# EAGLE schematic MM4_r0 (EAGLE 6.1)
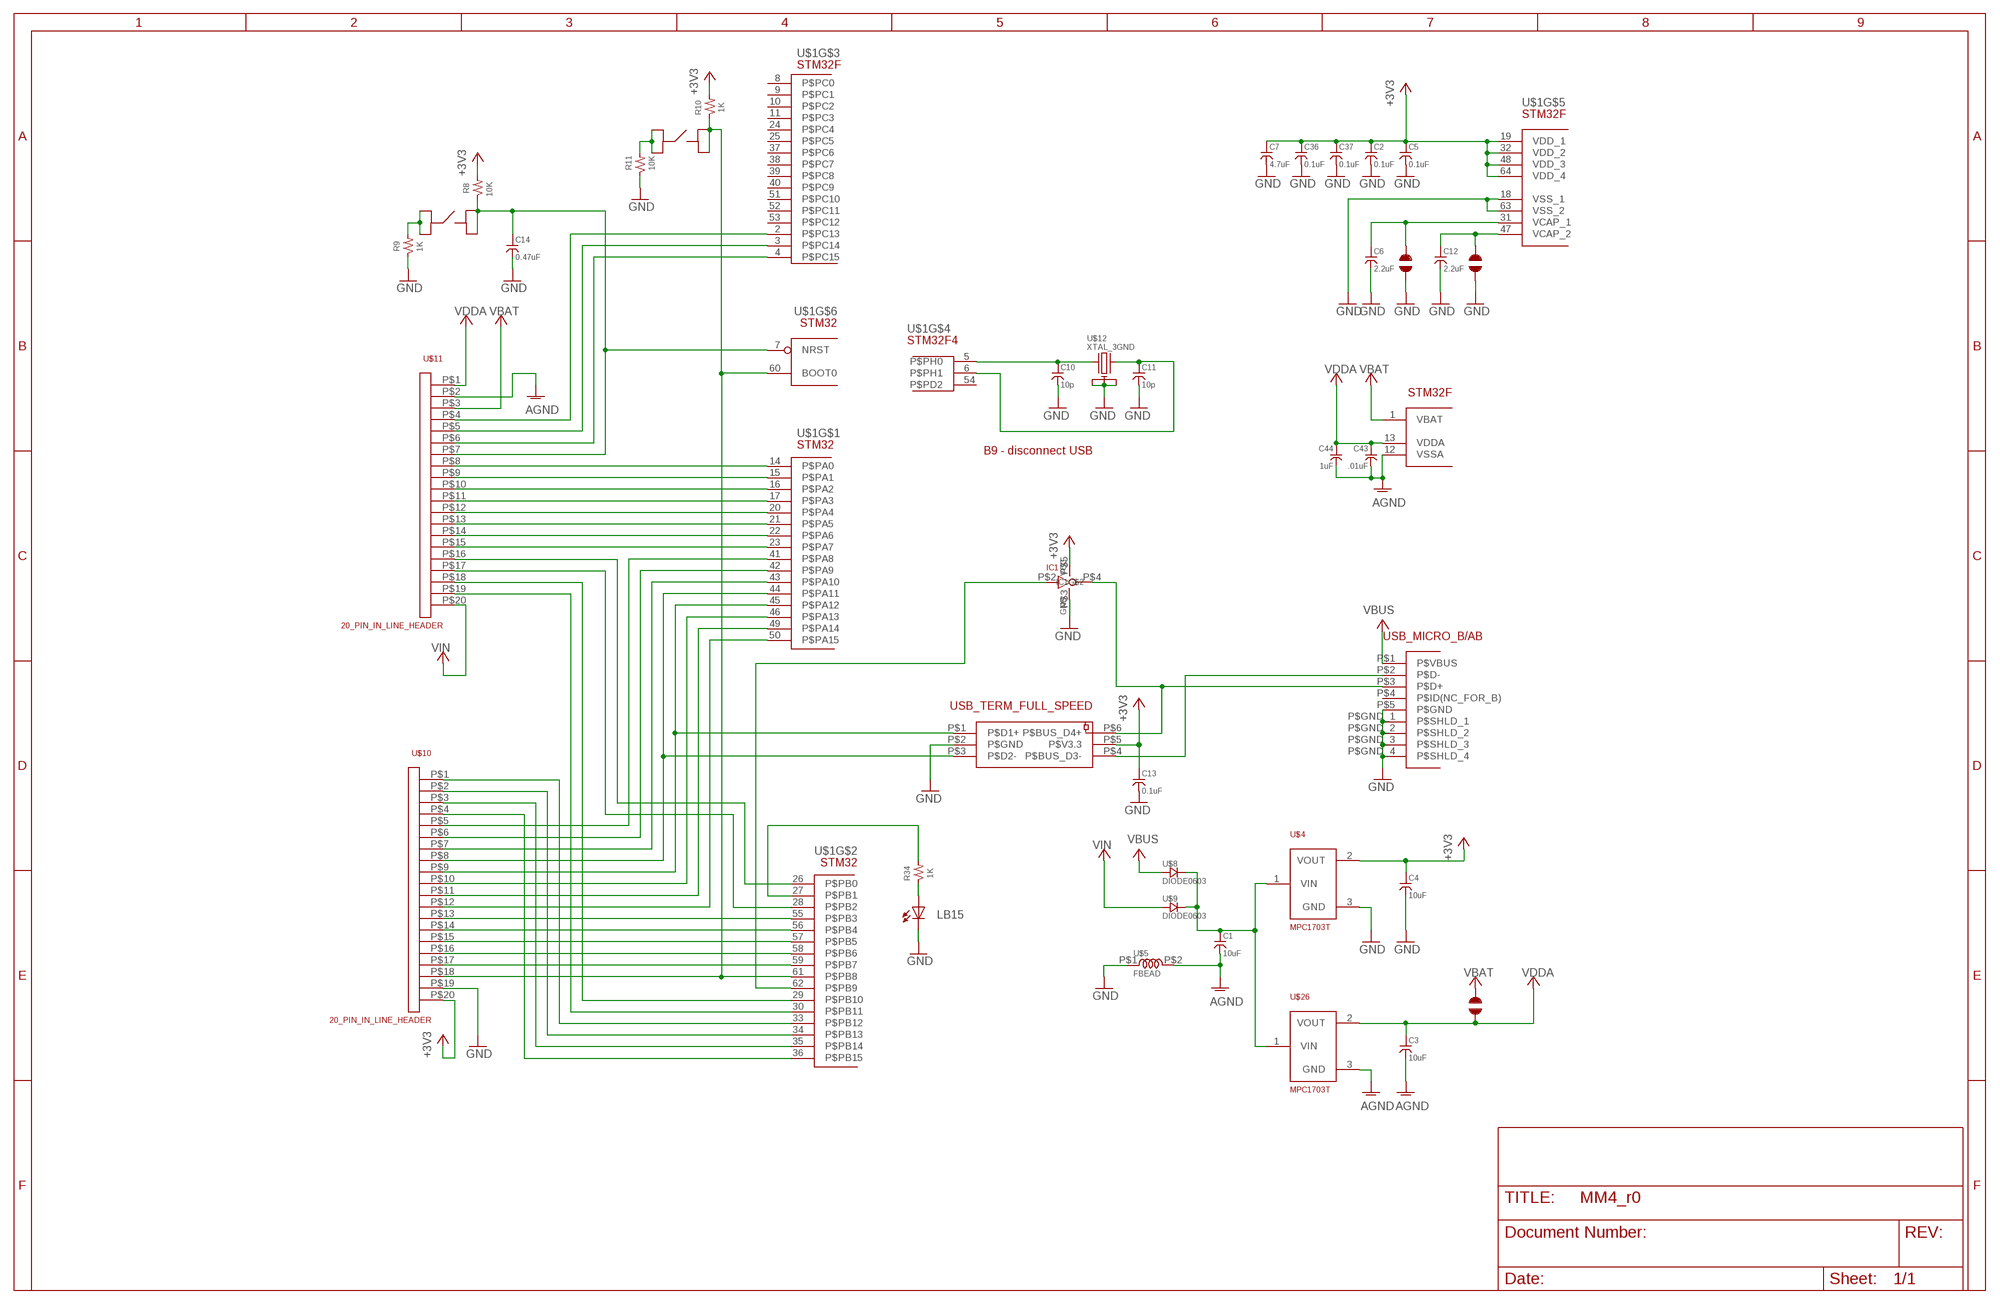
[diagram p0: schematic, sheet 1]

## Parts
C1  10uF  CAP0603  [0603]
C2  0.1uF  CAP0603  [0603]
C3  10uF  CAP0603  [0603]
C4  10uF  CAP0603  [0603]
C5  0.1uF  CAP0603  [0603]
C6  2.2uF  CAP0603  [0603]
C7  4.7uF  CAP0603  [0603]
C10  10p  CAP0603  [0603]
C11  10p  CAP0603  [0603]
C12  2.2uF  CAP0603  [0603]
C13  0.1uF  CAP0603  [0603]
C14  0.47uF  CAP0603  [0603]
C36  0.1uF  CAP0603  [0603]
C37  0.1uF  CAP0603  [0603]
C43  .01uF  CAP0603  [0603]
C44  1uF  CAP0603  [0603]
IC1  7SZ05  LOG_7SZ05  [SC-70-5]
LB15  LED_CMD280603+  [0603+]
R8  10K  RESISTOR0603  [0603]
R9  1K  RESISTOR0603  [0603]
R10  1K  RESISTOR0603  [0603]
R11  10K  RESISTOR0603  [0603]
R34  1K  RESISTOR0603  [0603]
U$1  STM32F40XRG  [TQFP64]
U$2  JUMPER_SOLDER  [JUMPER]
U$3  JUMPER_SOLDER  [JUMPER]
U$4  MPC1703T  [SOT23-3]
U$5  FBEAD  [BEAD_0603]
U$8  DIODE0603  [0603_DIODE]
U$9  DIODE0603  [0603_DIODE]
U$10  20_PIN_IN_LINE_HEADER  [20_PIN_IN_LINE]
U$11  20_PIN_IN_LINE_HEADER  [20_PIN_IN_LINE]
U$12  XTAL_3GND  [XTAL=TXC7M-3]
U$13  JUMPER_SOLDER  [JUMPER]
U$14  MICRO_USB_B  MICRO_USB_BMICRO  [USB-ZX-62-B-5PA]
U$23  USB_TERM_FS  [SOT-666IP]
U$24  SW_SMD_TACTILE  [SW_SMD_TACTILE]
U$25  SW_SMD_TACTILE  [SW_SMD_TACTILE]
U$26  MPC1703T  [SOT23-3]

## Nets
+3V3 [power]: C2.P$1 C4.P$1 C5.P$1 C7.P$1 C13.P$1 C36.P$1 C37.P$1 IC1.P$5(VCC) R8.P$1 R10.P$1 U$1.19(VDD_1) U$1.32(VDD_2) U$1.48(VDD_3) U$1.64(VDD_4) U$4.2(VOUT) U$10.P$20 U$23.P$5(P$V3.3)
AGND [power]: C1.P$2 C3.P$2 C43.P$2 C44.P$2 U$1.12(VSSA) U$5.P$2 U$11.P$2 U$26.3(GND)
GND [power]: C2.P$2 C4.P$2 C5.P$2 C6.P$2 C7.P$2 C10.P$2 C11.P$2 C12.P$2 C13.P$2 C14.P$2 C36.P$2 C37.P$2 IC1.P$3(GND) LB15.P$2-(C) R9.P$2 R11.P$2 U$1.18(VSS_1) U$1.63(VSS_2) U$2.P$1 U$3.P$1 U$4.3(GND) U$5.P$1 U$10.P$19 U$12.GND(P$GND_1) U$12.P$2(P$GND_2) U$12.P$4(P$GND_3) U$14.P$5(P$GND) U$14.P$GND_1(P$SHLD_1) U$14.P$GND_2(P$SHLD_2) U$14.P$GND_3(P$SHLD_3) U$14.P$GND_4(P$SHLD_4) U$23.P$2(P$GND)
N$1: C10.P$1 U$1.5(P$PH0) U$12.P$1(P$XT1)
N$2: LB15.P$1+(A) R34.P$2
N$3: C11.P$1 U$1.6(P$PH1) U$12.P$3(P$XT2)
N$4: U$1.14(P$PA0) U$11.P$8
N$5: U$1.15(P$PA1) U$11.P$9
N$6: U$1.2(P$PC13) U$11.P$4
N$7: R34.P$1 U$1.27(P$PB1)
N$8: U$14.P$2(P$D-) U$23.P$4(P$BUS_D3-)
N$9: U$1.16(P$PA2) U$11.P$10
N$10: U$1.17(P$PA3) U$11.P$11
N$11: U$1.20(P$PA4) U$11.P$12
N$12: U$1.21(P$PA5) U$11.P$13
N$13: U$1.22(P$PA6) U$11.P$14
N$14: U$1.23(P$PA7) U$11.P$15
N$15: U$1.26(P$PB0) U$11.P$16
N$16: U$1.28(P$PB2) U$11.P$17
N$17: U$1.29(P$PB10) U$11.P$18
N$18: IC1.P$4(P$OUT) U$14.P$3(P$D+) U$23.P$6(P$BUS_D4+)
N$20: U$1.30(P$PB11) U$11.P$19
N$21: U$1.33(P$PB12) U$10.P$1
N$22: U$1.34(P$PB13) U$10.P$2
N$23: U$1.35(P$PB14) U$10.P$3
N$24: U$1.36(P$PB15) U$10.P$4
N$25: U$1.41(P$PA8) U$10.P$5
N$26: U$1.42(P$PA9) U$10.P$6
N$27: U$1.43(P$PA10) U$10.P$7
N$28: U$1.44(P$PA11) U$10.P$8 U$23.P$3(P$D2-)
N$29: U$1.45(P$PA12) U$10.P$9 U$23.P$1(P$D1+)
N$30: U$1.46(P$PA13) U$10.P$10
N$31: U$1.49(P$PA14) U$10.P$11
N$32: U$1.50(P$PA15) U$10.P$12
N$33: U$1.55(P$PB3) U$10.P$13
N$34: U$1.56(P$PB4) U$10.P$14
N$35: U$1.57(P$PB5) U$10.P$15
N$36: U$1.58(P$PB6) U$10.P$16
N$37: U$1.59(P$PB7) U$10.P$17
N$38: R10.P$2 U$1.60(BOOT0) U$1.61(P$PB8) U$10.P$18 U$24.P$3 U$24.P$4
N$44: IC1.P$2(P$IN) U$1.62(P$PB9)
N$45: R9.P$1 U$25.P$1 U$25.P$2
N$46: C14.P$1 R8.P$2 U$1.7(NRST) U$11.P$7 U$25.P$3 U$25.P$4
N$47: R11.P$1 U$24.P$1 U$24.P$2
N$48: C1.P$1 U$4.1(VIN) U$8.P$2 U$9.P$2 U$26.1(VIN)
N$49: U$1.3(P$PC14) U$11.P$5
N$50: C6.P$1 U$1.31(VCAP_1) U$2.P$2
N$51: C12.P$1 U$1.47(VCAP_2) U$3.P$2
N$54: U$1.4(P$PC15) U$11.P$6
VBAT: U$1.1(VBAT) U$11.P$3 U$13.P$2
VBUS [power]: U$8.P$1 U$14.P$1(P$VBUS)
VDDA: C3.P$1 C43.P$1 C44.P$1 U$1.13(VDDA) U$11.P$1 U$13.P$1 U$26.2(VOUT)
VIN: U$9.P$1 U$11.P$20
Unconnected: U$1.8(P$PC0) U$1.9(P$PC1) U$1.10(P$PC2) U$1.11(P$PC3) U$1.24(P$PC4) U$1.25(P$PC5) U$1.37(P$PC6) U$1.38(P$PC7) U$1.39(P$PC8) U$1.40(P$PC9) U$1.51(P$PC10) U$1.52(P$PC11) U$1.53(P$PC12) U$1.54(P$PD2) U$14.P$4(P$ID(NC_FOR_B))

## Notes on the sheet
- B9 - disconnect USB

## Library data of the parts
C1-C7 C10-C14 C36 C37 C43 C44 = VAI:CAP: Surface mount caps
IC1 = VAI:LOG_7SZ05
LB15 = VAI:LED_CMD28: SMT Led
R8-R11 R34 = VAI:RESISTOR: SMD Resistor
U$1 = VAI:STM32F40XRG
U$2 U$3 U$13 = VAI:JUMPER_SOLDER
U$4 U$26 = VAI:MPC1703T: LDO voltage regulator 3.3V
U$5 = VAI:FBEAD
U$8 U$9 = VAI:DIODE
U$10 U$11 = VAI:20_PIN_IN_LINE_HEADER
U$12 = VAI:XTAL_3GND
U$14 = VAI:MICRO_USB_B: Micro USB B Connector
U$23 = VAI:USB_TERM_FS
U$24 U$25 = VAI:SW_SMD_TACTILE

## Net classes
0 default: width 0.178 mm, clearance 0.178 mm
1 power: width 0.178 mm, clearance 0.178 mm